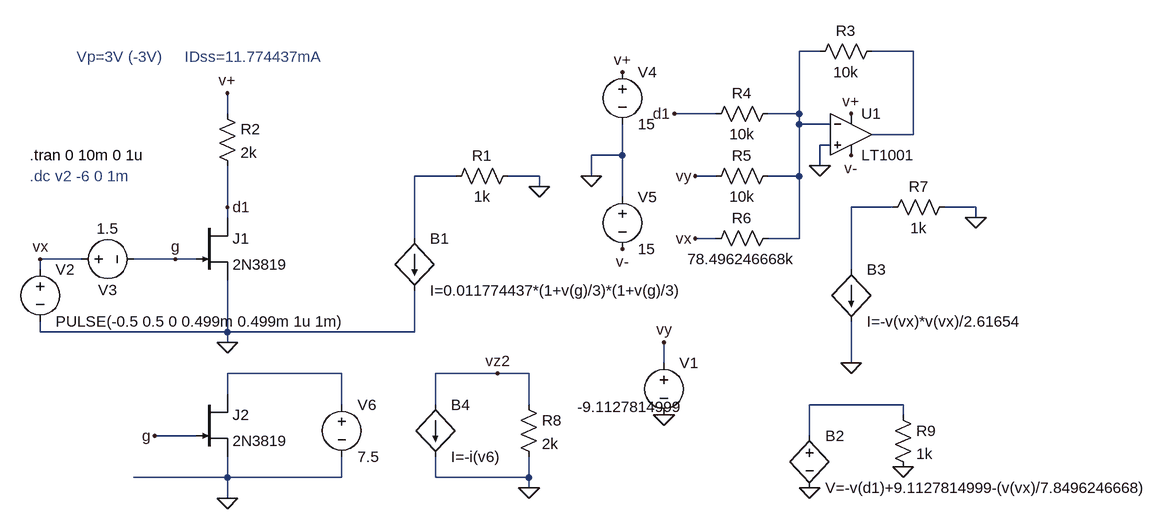
[diagram p0: schematic jfet_transf.asc]
jfet_transf.asc, the LTspice schematic file:
Version 4
SHEET 1 1732 680
WIRE 1152 -112 1120 -112
WIRE 1296 -112 1232 -112
WIRE 240 -16 240 -48
WIRE 992 -16 928 -16
WIRE 1120 -16 1120 -112
WIRE 1120 -16 1072 -16
WIRE 1120 0 1120 -16
WIRE 1168 0 1120 0
WIRE 1296 16 1296 -112
WIRE 1296 16 1232 16
WIRE 1168 32 1152 32
WIRE 848 48 848 0
WIRE 848 48 800 48
WIRE 1152 64 1152 32
WIRE 592 80 528 80
WIRE 720 80 672 80
WIRE 800 80 800 48
WIRE 992 80 960 80
WIRE 1120 80 1120 0
WIRE 1120 80 1072 80
WIRE 720 96 720 80
WIRE 848 112 848 48
WIRE 240 128 240 64
WIRE 1264 128 1200 128
WIRE 1392 128 1344 128
WIRE 240 144 240 128
WIRE 1392 144 1392 128
WIRE 528 176 528 80
WIRE 992 176 960 176
WIRE 1120 176 1120 80
WIRE 1120 176 1072 176
WIRE 16 208 -48 208
WIRE 160 208 96 208
WIRE 192 208 160 208
WIRE -48 224 -48 208
WIRE 1200 224 1200 128
WIRE -48 320 -48 304
WIRE 240 320 240 240
WIRE 240 320 -48 320
WIRE 528 320 528 256
WIRE 528 320 240 320
WIRE 240 336 240 320
WIRE 912 368 912 336
WIRE 1200 368 1200 304
WIRE 416 384 240 384
WIRE 656 384 560 384
WIRE 704 384 656 384
WIRE 240 416 240 384
WIRE 416 432 416 384
WIRE 560 432 560 384
WIRE 704 432 704 384
WIRE 1280 432 1136 432
WIRE 1280 448 1280 432
WIRE 192 480 128 480
WIRE 1136 480 1136 432
WIRE 240 544 240 512
WIRE 240 544 96 544
WIRE 416 544 416 512
WIRE 416 544 240 544
WIRE 560 544 560 512
WIRE 704 544 704 512
WIRE 704 544 560 544
WIRE 704 560 704 544
WIRE 240 576 240 544
FLAG 240 336 0
FLAG 160 208 g
FLAG 720 96 0
FLAG 800 80 0
FLAG 848 -80 v+
FLAG 848 192 v-
FLAG 240 -48 v+
FLAG 1200 -16 v+
FLAG 1200 48 v-
FLAG -48 208 vx
FLAG 960 176 vx
FLAG 912 448 0
FLAG 912 336 vy
FLAG 960 80 vy
FLAG 240 128 d1
FLAG 1152 64 0
FLAG 1392 144 0
FLAG 1200 368 0
FLAG 128 480 g
FLAG 240 576 0
FLAG 704 560 0
FLAG 656 384 vz2
FLAG 928 -16 d1
FLAG 1136 560 0
FLAG 1280 528 0
SYMBOL njf 192 144 R0
SYMATTR InstName J1
SYMATTR Value 2N3819
SYMBOL voltage -48 208 R0
WINDOW 123 0 0 Left 0
WINDOW 39 0 0 Left 0
SYMATTR InstName V2
SYMATTR Value PULSE(-0.5 0.5 0 0.499m 0.499m 1u 1m)
SYMBOL bi 528 176 R0
SYMATTR InstName B1
SYMATTR Value I=0.011774437*(1+v(g)/3)*(1+v(g)/3)
SYMBOL res 688 64 R90
WINDOW 0 0 56 VBottom 2
WINDOW 3 32 56 VTop 2
SYMATTR InstName R1
SYMATTR Value 1k
SYMBOL res 224 -32 R0
SYMATTR InstName R2
SYMATTR Value 2k
SYMBOL voltage 0 208 R270
WINDOW 0 -32 56 VBottom 2
WINDOW 3 32 56 VTop 2
WINDOW 123 0 0 Left 0
WINDOW 39 0 0 Left 0
SYMATTR InstName V3
SYMATTR Value 1.5
SYMBOL voltage 848 -96 R0
WINDOW 123 0 0 Left 0
WINDOW 39 0 0 Left 0
SYMATTR InstName V4
SYMATTR Value 15
SYMBOL voltage 848 96 R0
WINDOW 123 0 0 Left 0
WINDOW 39 0 0 Left 0
SYMATTR InstName V5
SYMATTR Value 15
SYMBOL OpAmps\\LT1001 1200 -48 R0
SYMATTR InstName U1
SYMBOL res 1248 -128 R90
WINDOW 0 0 56 VBottom 2
WINDOW 3 32 56 VTop 2
SYMATTR InstName R3
SYMATTR Value 10k
SYMBOL res 1088 -32 R90
WINDOW 0 0 56 VBottom 2
WINDOW 3 32 56 VTop 2
SYMATTR InstName R4
SYMATTR Value 10k
SYMBOL res 1088 64 R90
WINDOW 0 0 56 VBottom 2
WINDOW 3 32 56 VTop 2
SYMATTR InstName R5
SYMATTR Value 10k
SYMBOL res 1088 160 R90
WINDOW 0 0 56 VBottom 2
WINDOW 3 32 56 VTop 2
SYMATTR InstName R6
SYMATTR Value 78.496246668k
SYMBOL voltage 912 352 R0
WINDOW 3 -133 83 Left 2
WINDOW 123 0 0 Left 0
WINDOW 39 0 0 Left 0
SYMATTR Value -9.1127814999
SYMATTR InstName V1
SYMBOL bi 1200 224 R0
SYMATTR InstName B3
SYMATTR Value I=-v(vx)*v(vx)/2.61654
SYMBOL res 1360 112 R90
WINDOW 0 0 56 VBottom 2
WINDOW 3 32 56 VTop 2
SYMATTR InstName R7
SYMATTR Value 1k
SYMBOL njf 192 416 R0
SYMATTR InstName J2
SYMATTR Value 2N3819
SYMBOL voltage 416 416 R0
WINDOW 123 0 0 Left 0
WINDOW 39 0 0 Left 0
SYMATTR InstName V6
SYMATTR Value 7.5
SYMBOL bi 560 432 R0
SYMATTR InstName B4
SYMATTR Value I=-i(v6)
SYMBOL res 688 416 R0
SYMATTR InstName R8
SYMATTR Value 2k
SYMBOL bv 1136 464 R0
SYMATTR InstName B2
SYMATTR Value V=-v(d1)+9.1127814999-(v(vx)/7.8496246668)
SYMBOL res 1264 432 R0
SYMATTR InstName R9
SYMATTR Value 1k
TEXT -64 80 Left 2 ;.dc v2 -6 0 1m
TEXT -64 48 Left 2 !.tran 0 10m 0 1u
TEXT 8 -104 Left 2 ;Vp=3V (-3V)     IDss=11.774437mA

The netlist it stands for:
* jfet_transf.asc
J1 d1 g 0 2N3819
V2 vx 0 PULSE(-0.5 0.5 0 0.499m 0.499m 1u 1m)
B1 N003 0 I=0.011774437*(1+v(g)/3)*(1+v(g)/3)
R1 0 N003 1k
R2 v+ d1 2k
V3 vx g 1.5
V4 v+ 0 15
V5 0 v- 15
XU1 0 N001 v+ v- N002 LT1001  ; pins In+ In- V+ V- OUT
R3 N002 N001 10k
R4 N001 d1 10k
R5 N001 vy 10k
R6 N001 vx 78.496246668k
V1 vy 0 -9.1127814999
B3 N004 0 I=-v(vx)*v(vx)/2.61654
R7 0 N004 1k
J2 N005 g 0 2N3819
V6 N005 0 7.5
B4 vz2 0 I=-i(v6)
R8 vz2 0 2k
B2 N006 0 V=-v(d1)+9.1127814999-(v(vx)/7.8496246668)
R9 N006 0 1k
.model NJF NJF
.model PJF PJF
.lib standard.jft
* .dc v2 -6 0 1m
.tran 0 10m 0 1u
* Vp=3V (-3V)     IDss=11.774437mA
.lib LTC.lib
.backanno
.end